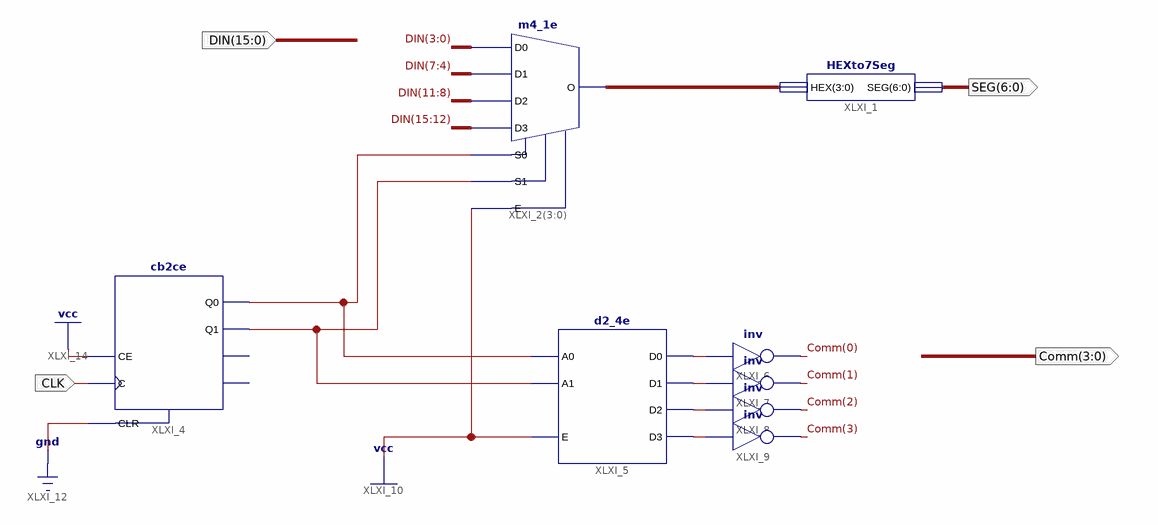
[diagram p0: schematic sheet 1]
// Xilinx ISE schematic HexTo7Seg4Bit.sch (spartan6) as structural Verilog: 8 symbols, 4 ports
module HexTo7Seg4Bit (
  input  [15:0] DIN,
  input  CLK,
  output [6:0] SEG,
  output [3:0] Comm
);

  wire XLXN_6, XLXN_7, XLXN_8, XLXN_9, XLXN_10, XLXN_11;
  wire [3:0] XLXN_1;

  HEXto7Seg XLXI_1 (.HEX(XLXN_1), .SEG(SEG));
  m4_1e XLXI_2[3:0] (
    .D0(DIN[3:0]), .D1(DIN[7:4]), .D2(DIN[11:8]), .D3(DIN[15:12]), .E(1'b1), .S0(XLXN_6), .S1(XLXN_7),
    .O(XLXN_1));
  cb2ce XLXI_4 (.C(CLK), .CE(1'b1), .CLR(1'b0), .Q0(XLXN_6), .Q1(XLXN_7));  // open: CEO, TC
  d2_4e XLXI_5 (.A0(XLXN_6), .A1(XLXN_7), .E(1'b1), .D0(XLXN_8), .D1(XLXN_9), .D2(XLXN_10), .D3(XLXN_11));
  not XLXI_6 (Comm[0], XLXN_8);
  not XLXI_7 (Comm[1], XLXN_9);
  not XLXI_8 (Comm[2], XLXN_10);
  not XLXI_9 (Comm[3], XLXN_11);
endmodule
